# EAGLE schematic OOBD-Tiger (EAGLE 7.6.0)

## Sheet 1 of 5
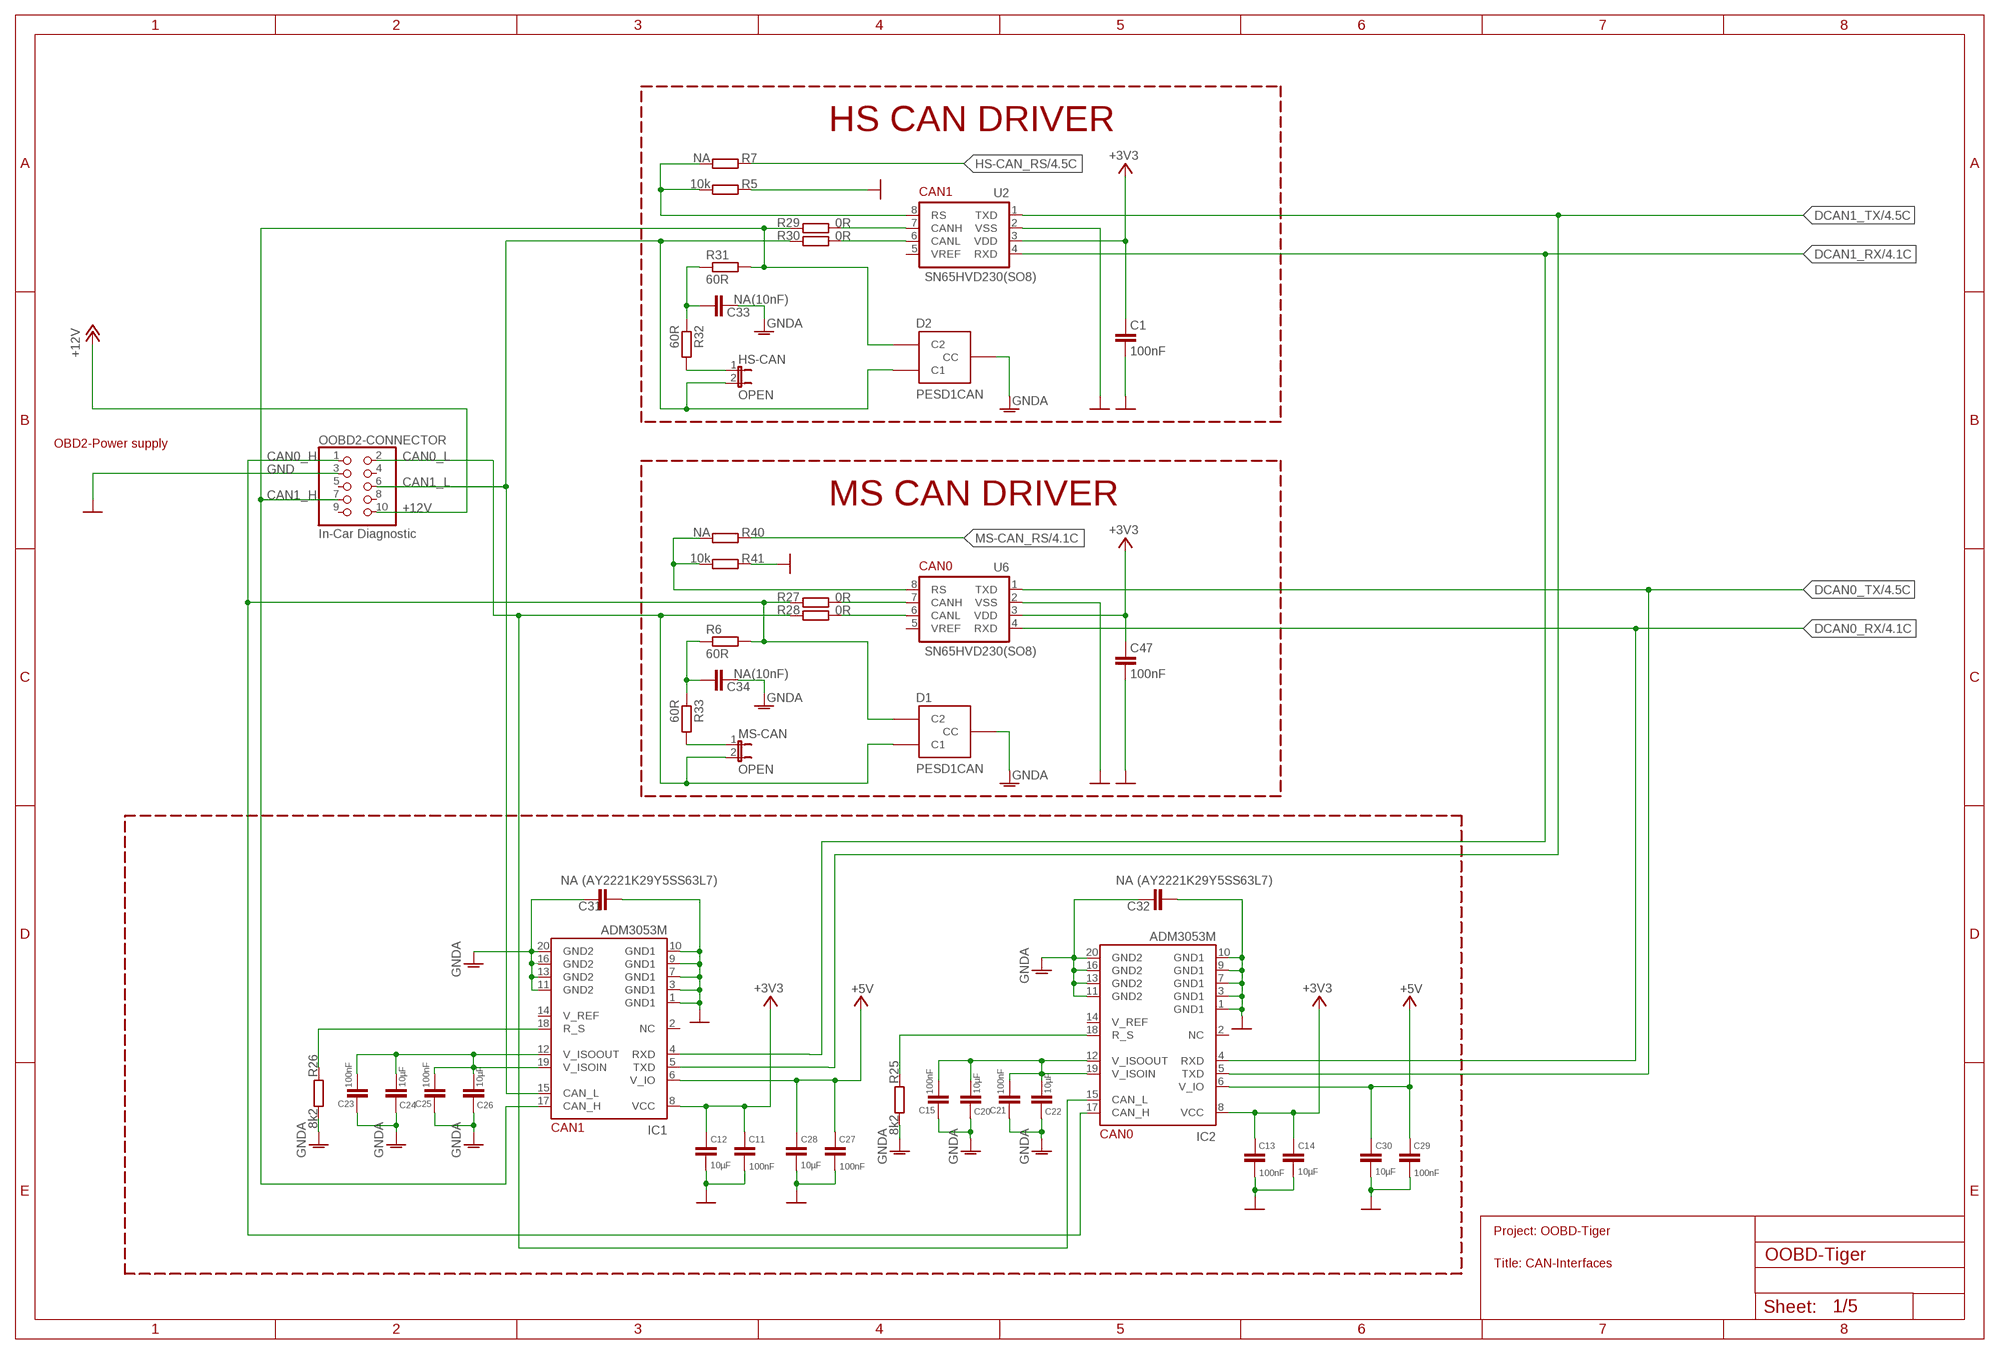
[diagram p0: schematic, sheet 1]

### Parts
C1  100nF  C-EUC0603K  [C0603K]
C11  100nF  C-EUC0603K  [C0603K]
C12  10µF  C-EUC0805K  [C0805K]
C13  100nF  C-EUC0603K  [C0603K]
C14  10µF  C-EUC0805K  [C0805K]
C15  100nF  C-EUC0603K  [C0603K]
C20  10µF  C-EUC0805K  [C0805K]
C21  100nF  C-EUC0603K  [C0603K]
C22  10µF  C-EUC0805K  [C0805K]
C23  100nF  C-EUC0603K  [C0603K]
C24  10µF  C-EUC0805K  [C0805K]
C25  100nF  C-EUC0603K  [C0603K]
C26  10µF  C-EUC0805K  [C0805K]
C27  100nF  C-EUC0603K  [C0603K]
C28  10µF  C-EUC0805K  [C0805K]
C29  100nF  C-EUC0603K  [C0603K]
C30  10µF  C-EUC0805K  [C0805K]
C31  NA (AY2221K29Y5SS63L7)  C-EU075-032X103  [C075-032X103]
C32  NA (AY2221K29Y5SS63L7)  C-EU075-032X103  [C075-032X103]
C33  NA(10nF)  C-EUC0603  [C0603]
C34  NA(10nF)  C-EUC0603  [C0603]
C47  100nF  C-EUC0603K  [C0603K]
D1  PESD1CAN  [SOT23]
D2  PESD1CAN  [SOT23]
HS-CAN  OPEN  JUMPER-2PTH  [1X02]
IC1  ADM3053M  [SO20W]
IC2  ADM3053M  [SO20W]
MS-CAN  OPEN  JUMPER-2PTH  [1X02]
OOBD2-CONNECTOR  In-Car Diagnostic  PINHD-2X5/90  [2X05/90]
R5  10k  R-EU_R0603  [R0603]
R6  60R  R-EU_R0603  [R0603]
R7  NA  R-EU_R0603  [R0603]
R25  8k2  R-EU_R0603  [R0603]
R26  8k2  R-EU_R0603  [R0603]
R27  0R  R-EU_0207/10  [0207/10]
R28  0R  R-EU_0207/10  [0207/10]
R29  0R  R-EU_0207/10  [0207/10]
R30  0R  R-EU_0207/10  [0207/10]
R31  60R  R-EU_R0603  [R0603]
R32  60R  R-EU_R0603  [R0603]
R33  60R  R-EU_R0603  [R0603]
R40  NA  R-EU_R0603  [R0603]
R41  10k  R-EU_R0603  [R0603]
U2  SN65HVD230(SO8)  MCP2551  [SO-08]
U6  SN65HVD230(SO8)  MCP2551  [SO-08]

### Nets
+3V3: C1.1 C11.1 C12.1 C13.1 C14.1 C47.1 IC1.8(VCC) IC2.8(VCC) U2.3(VDD) U6.3(VDD) ; also sheet 3,5
+5V: C27.1 C28.1 C29.1 C30.1 IC1.6(V_IO) IC2.6(V_IO) ; also sheet 2,3,4,5
+12V: OOBD2-CONNECTOR.10 ; also sheet 5
CAN0_H: D1.2(C2) IC2.17(CAN_H) OOBD2-CONNECTOR.1 R6.2 R27.1
CAN0_L: D1.1(C1) IC2.15(CAN_L) MS-CAN.2 OOBD2-CONNECTOR.2 R28.1
CAN1_H: D2.2(C2) IC1.17(CAN_H) OOBD2-CONNECTOR.7 R29.2 R31.2
CAN1_L: D2.1(C1) HS-CAN.2 IC1.15(CAN_L) OOBD2-CONNECTOR.6 R30.1
DCAN0_RX: IC2.4(RXD) U6.4(RXD) ; also sheet 4
DCAN0_TX: IC2.5(TXD) U6.1(TXD) ; also sheet 4
DCAN1_RX: IC1.4(RXD) U2.4(RXD) ; also sheet 4
DCAN1_TX: IC1.5(TXD) U2.1(TXD) ; also sheet 4
GND [PWR]: C1.2 C11.2 C12.2 C13.2 C14.2 C27.2 C28.2 C29.2 C30.2 C31.2 C32.2 C47.2 IC1.1(GND1) IC1.3(GND1) IC1.7(GND1) IC1.9(GND1) IC1.10(GND1) IC2.1(GND1) IC2.3(GND1) IC2.7(GND1) IC2.9(GND1) IC2.10(GND1) OOBD2-CONNECTOR.3 R5.2 R41.2 U2.2(VSS) U6.2(VSS) ; also sheet 2,3,4,5
GNDA [PWR]: C15.2 C20.2 C21.2 C22.2 C23.2 C24.2 C25.2 C26.2 C31.1 C32.1 C33.2 C34.2 D1.3(CC) D2.3(CC) IC1.11(GND2) IC1.13(GND2) IC1.16(GND2) IC1.20(GND2) IC2.11(GND2) IC2.13(GND2) IC2.16(GND2) IC2.20(GND2) R25.1 R26.1
HS-CAN_RS: R7.2 ; also sheet 4
MS-CAN_RS: R40.2 ; also sheet 4
N$2: C33.1 R31.1 R32.1
N$5: R5.1 R7.1 U2.8(RS)
N$10: C34.1 R6.1 R33.1
N$30: HS-CAN.1 R32.2
N$31: C23.1 C24.1 C25.1 C26.1 IC1.12(V_ISOOUT) IC1.19(V_ISOIN)
N$32: MS-CAN.1 R33.2
N$33: IC2.18(R_S) R25.2
N$40: R27.2 U6.7(CANH)
N$41: R30.2 U2.6(CANL)
N$42: R28.2 U6.6(CANL)
N$45: R29.1 U2.7(CANH)
N$50: C15.1 C20.1 C21.1 C22.1 IC2.12(V_ISOOUT) IC2.19(V_ISOIN)
N$52: IC1.18(R_S) R26.2
N$80: R40.1 R41.1 U6.8(RS)
Unconnected: IC1.2(NC) IC1.14(V_REF) IC2.2(NC) IC2.14(V_REF) OOBD2-CONNECTOR.4 OOBD2-CONNECTOR.5 OOBD2-CONNECTOR.8 OOBD2-CONNECTOR.9 U2.5(VREF) U6.5(VREF)

### Notes on the sheet
- HS CAN DRIVER
- CAN1
- OBD2-Power supply
- MS CAN DRIVER
- CAN0
- DCAN0_TX
- DCAN0_RX
- CAN1
- CAN0
- Project: OOBD-Tiger
- Title: CAN-Interfaces

## Sheet 2 of 5
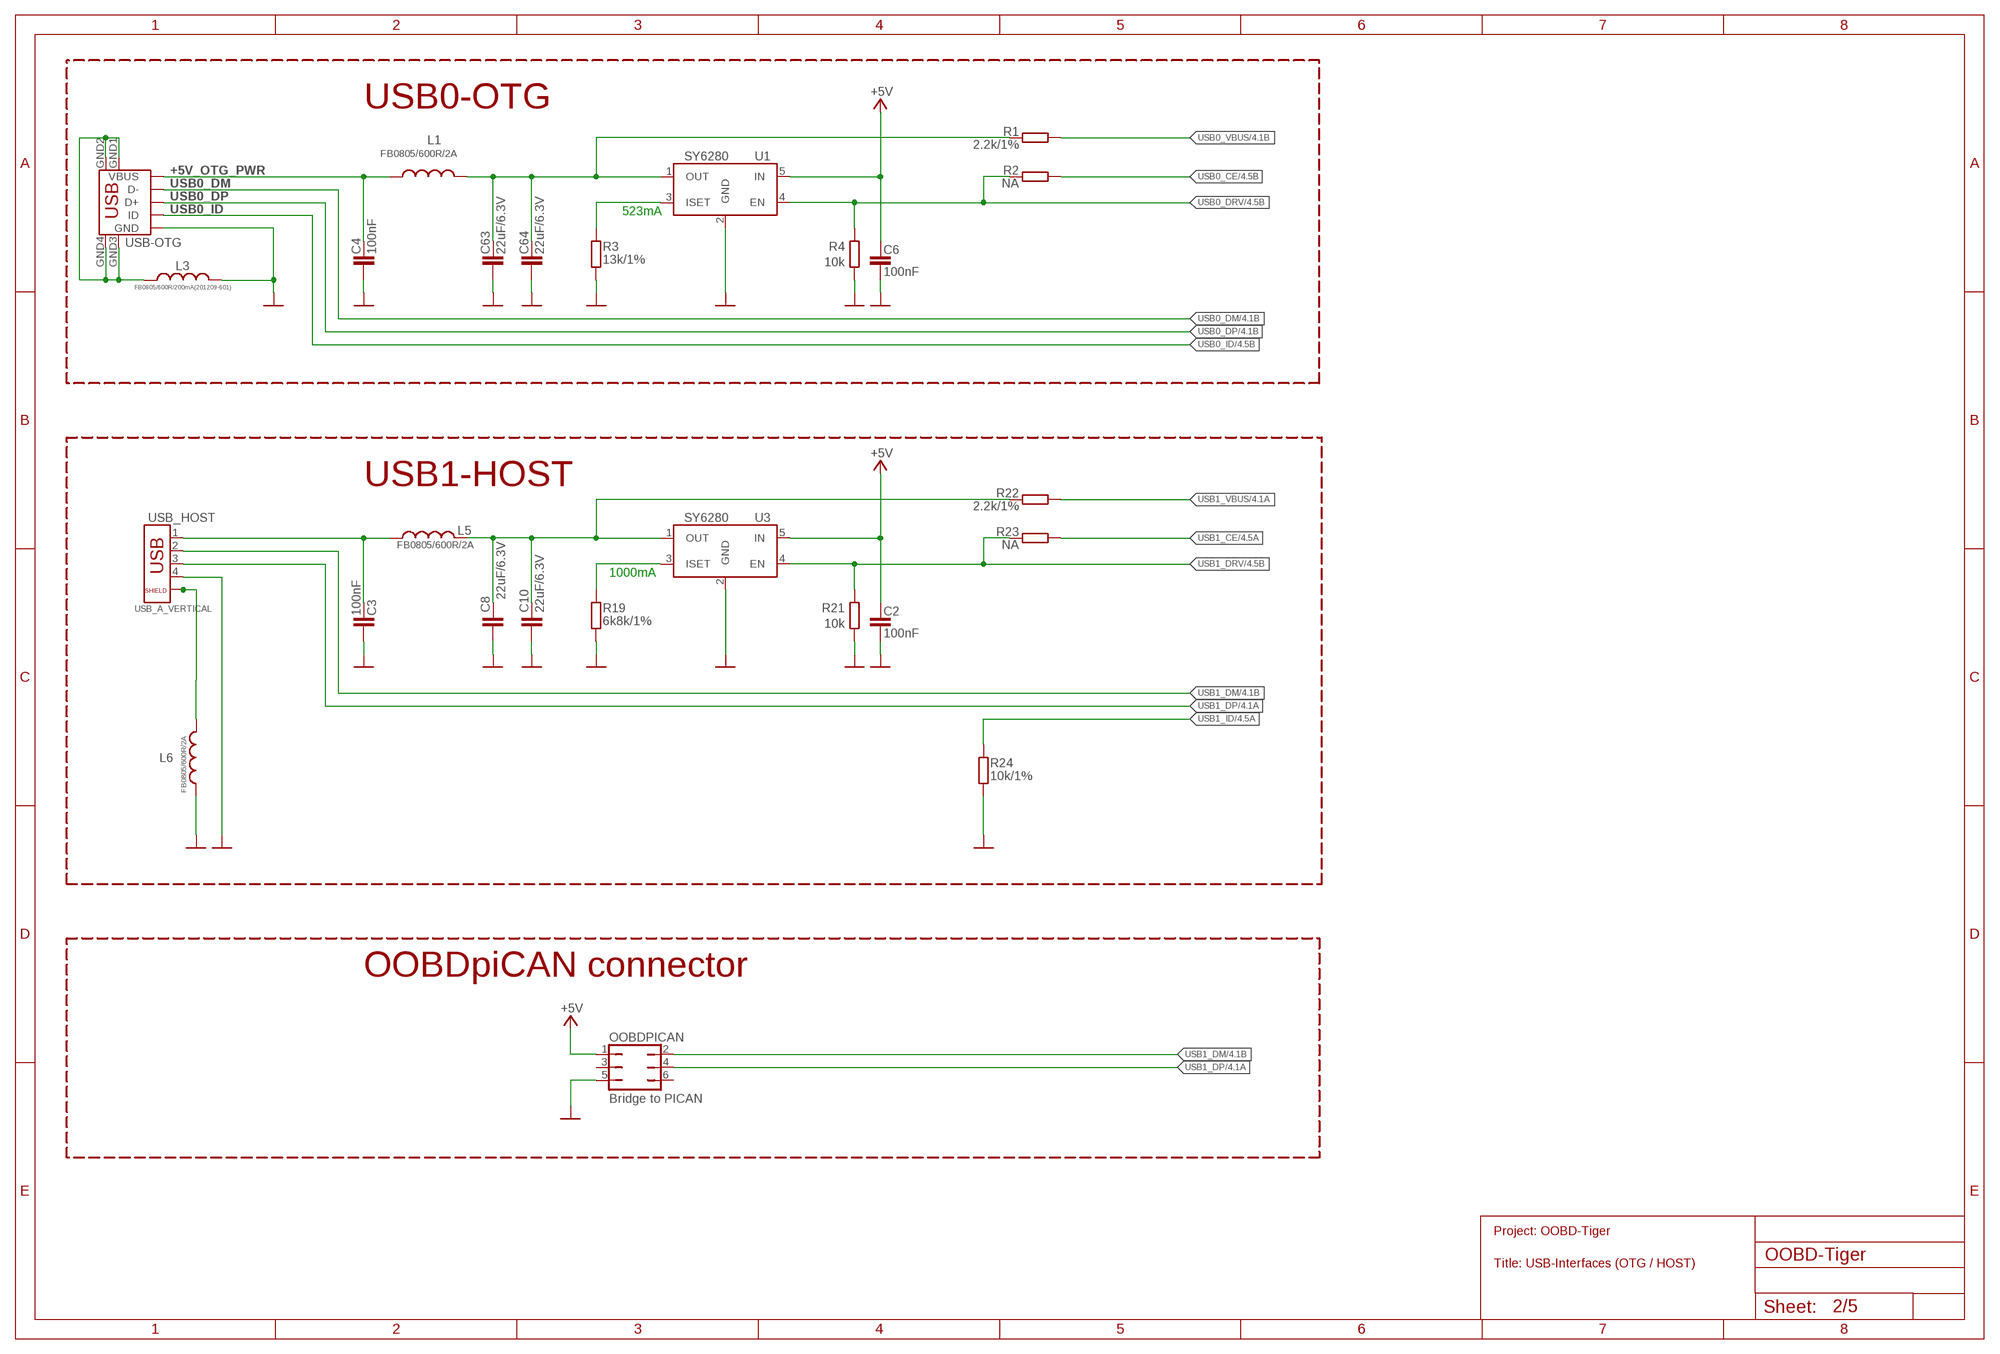
[diagram p1: schematic, sheet 2]

### Parts
C2  100nF  C-EUC0603K  [C0603K]
C3  100nF  C-EUC0603K  [C0603K]
C4  100nF  C-EUC0603K  [C0603K]
C6  100nF  C-EUC0603K  [C0603K]
C8  22uF/6.3V  C-EUC0603  [C0603]
C10  22uF/6.3V  C-EUC0603  [C0603]
C63  22uF/6.3V  C-EUC0603  [C0603]
C64  22uF/6.3V  C-EUC0603  [C0603]
L1  FB0805/600R/2A  L-USL0603  [L0603]
L3  FB0805/600R/200mA(201209-601)  L-USL0603  [L0603]
L5  FB0805/600R/2A  L-USL0603  [L0603]
L6  FB0805/600R/2A  L-USL0603  [L0603]
OOBDPICAN  Bridge to PICAN  JP3Q  [JP3Q]
R1  2.2k/1%  R-EU_R0603  [R0603]
R2  NA  R-EU_R0603  [R0603]
R3  13k/1%  R-EU_R0603  [R0603]
R4  10k  R-EU_R0603  [R0603]
R19  6k8k/1%  R-EU_R0603  [R0603]
R21  10k  R-EU_R0603  [R0603]
R22  2.2k/1%  R-EU_R0603  [R0603]
R23  NA  R-EU_R0603  [R0603]
R24  10k/1%  R-EU_R0603  [R0603]
U1  SY6280  [SOT23-5]
U3  SY6280  [SOT23-5]
USB_HOST  USB_A_VERTICAL  USB_SHIELD1  [USB_PN87520_DEV_PTH]
USB_OTG  USB-OTG  MINI_USB9  [USB_MINI_9PIN]

### Nets
+5V: C2.1 C6.1 OOBDPICAN.1 U1.5(IN) U3.5(IN) ; also sheet 1,3,4,5
+5V_OTG_PWR: C4.1 L1.1 USB_OTG.VBUS
GND [PWR]: C2.2 C3.2 C4.2 C6.2 C8.2 C10.2 C63.2 C64.2 L3.1 L6.1 OOBDPICAN.5 R3.1 R4.1 R19.1 R21.1 R24.1 U1.2(GND) U3.2(GND) USB_HOST.4 USB_OTG.GND ; also sheet 1,3,4,5
N$3: R19.2 U3.3(ISET)
N$13: C8.1 C10.1 L5.1 R22.2 U3.1(OUT)
N$28: C3.1 L5.2 USB_HOST.1
N$29: L6.2 USB_HOST.P$1 USB_HOST.P$2
N$99: R3.2 U1.3(ISET)
N$100: C63.1 C64.1 L1.2 R1.2 U1.1(OUT)
N$266: L3.2 USB_OTG.GND1 USB_OTG.GND2 USB_OTG.GND3 USB_OTG.GND4
USB0_CE: R2.2 ; also sheet 4
USB0_DM: USB_OTG.D- ; also sheet 4
USB0_DP: USB_OTG.D+ ; also sheet 4
USB0_DRV: R2.1 R4.2 U1.4(EN) ; also sheet 4
USB0_ID: USB_OTG.ID ; also sheet 4
USB0_VBUS: R1.1 ; also sheet 4
USB1_CE: R23.2 ; also sheet 4
USB1_DM: OOBDPICAN.2 USB_HOST.2 ; also sheet 4
USB1_DP: OOBDPICAN.4 USB_HOST.3 ; also sheet 4
USB1_DRV: R21.2 R23.1 U3.4(EN) ; also sheet 4
USB1_ID: R24.2 ; also sheet 4
USB1_VBUS: R22.1 ; also sheet 4
Unconnected: OOBDPICAN.3 OOBDPICAN.6

### Notes on the sheet
- USB0-OTG
- 523mA
- Iset = 6800/Rs
- Rs
- Iset = 523mA
- USB1-HOST
- 1000mA
- OOBDpiCAN connector
- Project: OOBD-Tiger
- Title: USB-Interfaces (OTG / HOST)

## Sheet 3 of 5
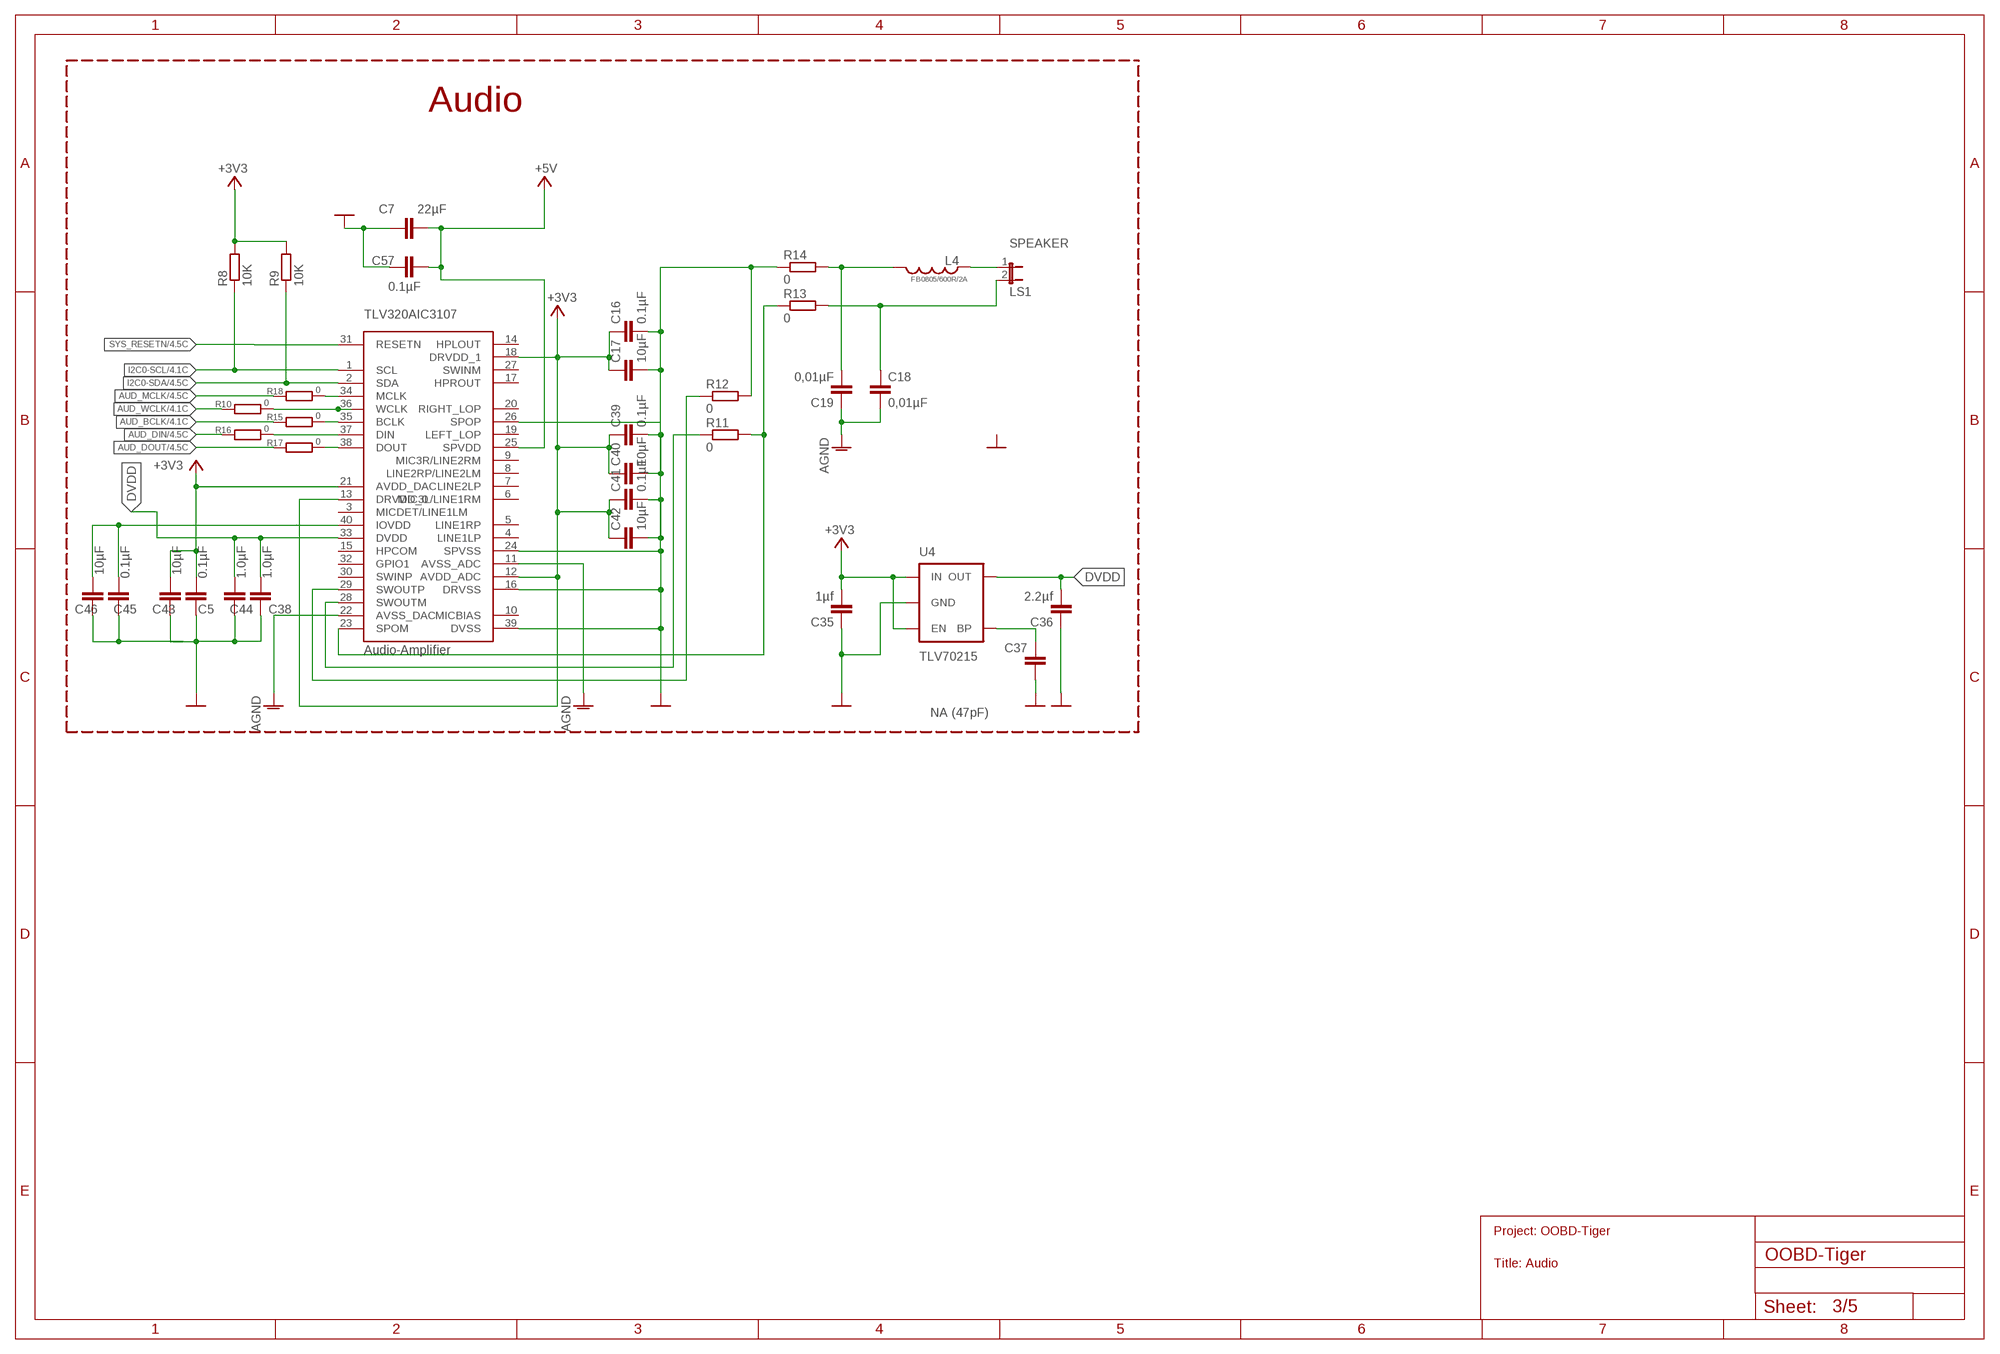
[diagram p2: schematic, sheet 3]

### Parts
C5  0.1µF  CAP0603-CAP  [0603-CAP]
C7  22µF  CAP0603-CAP  [0603-CAP]
C16  0.1µF  CAP0603-CAP  [0603-CAP]
C17  10µF  CAP0603-CAP  [0603-CAP]
C18  0,01µF  CAP0603-CAP  [0603-CAP]
C19  0,01µF  CAP0603-CAP  [0603-CAP]
C35  1µf  CAP0603-CAP  [0603-CAP]
C36  2.2µf  CAP0603-CAP  [0603-CAP]
C37  NA (47pF)  CAP0603-CAP  [0603-CAP]
C38  1.0µF  CAP0603-CAP  [0603-CAP]
C39  0.1µF  CAP0603-CAP  [0603-CAP]
C40  10µF  CAP0603-CAP  [0603-CAP]
C41  0.1µF  CAP0603-CAP  [0603-CAP]
C42  10µF  CAP0603-CAP  [0603-CAP]
C43  10µF  CAP0603-CAP  [0603-CAP]
C44  1.0µF  CAP0603-CAP  [0603-CAP]
C45  0.1µF  CAP0603-CAP  [0603-CAP]
C46  10µF  CAP0603-CAP  [0603-CAP]
C57  0.1µF  CAP0603-CAP  [0603-CAP]
L4  FB0805/600R/2A  L-USL0603  [L0603]
R8  10K  R-EU_R0603  [R0603]
R9  10K  R-EU_R0603  [R0603]
R10  0  R-EU_R0603  [R0603]
R11  0  R-EU_R0603  [R0603]
R12  0  R-EU_R0603  [R0603]
R13  0  R-EU_R0603  [R0603]
R14  0  R-EU_R0603  [R0603]
R15  0  R-EU_R0603  [R0603]
R16  0  R-EU_R0603  [R0603]
R17  0  R-EU_R0603  [R0603]
R18  0  R-EU_R0603  [R0603]
SPEAKER  LS1  JUMPER-2PTH  [1X02]
TLV320AIC3107  Audio-Amplifier  TLV320AIC3107  [QFN40-6X6]
U4  TLV70215  V_REG_LDOSMD  [SOT23-5]

### Nets
+3V3: C5.2 C16.1 C17.1 C35.2 C39.1 C40.1 C41.1 C42.1 C43.2 R8.2 R9.2 TLV320AIC3107.12(AVDD_ADC) TLV320AIC3107.13(DRVDD_0) TLV320AIC3107.18(DRVDD_1) TLV320AIC3107.21(AVDD_DAC) U4.1(IN) U4.3(EN) ; also sheet 1,5
+5V: C7.2 C57.2 TLV320AIC3107.25(SPVDD) ; also sheet 1,2,4,5
AGND: C18.2 C19.1 TLV320AIC3107.11(AVSS_ADC) TLV320AIC3107.22(AVSS_DAC)
AUD_BCLK: R15.1 ; also sheet 4
AUD_DIN: R16.1 ; also sheet 4
AUD_DOUT: R17.1 ; also sheet 4
AUD_MCLK: R18.1 ; also sheet 4
AUD_WCLK: R10.1 ; also sheet 4
DVDD: C36.2 C38.2 C44.2 TLV320AIC3107.33(DVDD) U4.5(OUT)
GND [PWR]: C5.1 C7.1 C16.2 C17.2 C35.1 C36.1 C37.1 C38.1 C39.2 C40.2 C41.2 C42.2 C43.1 C44.1 C57.1 R12.2 R14.1 TLV320AIC3107.16(DRVSS) TLV320AIC3107.24(SPVSS) TLV320AIC3107.26(SPOP) TLV320AIC3107.39(DVSS) U4.2(GND) ; also sheet 1,2,4,5
GND1 [PWR]: C45.1 C46.1
I2C0-SCL: R8.1 TLV320AIC3107.1(SCL) ; also sheet 4,5
I2C0-SDA: R9.1 TLV320AIC3107.2(SDA) ; also sheet 4,5
N$12: C37.2 U4.4(BP)
N$14: C19.2 L4.2 R14.2
N$15: C18.1 R13.2 SPEAKER.2
N$16: L4.1 SPEAKER.1
N$18: R11.2 R13.1 TLV320AIC3107.23(SPOM)
N$19: R11.1 TLV320AIC3107.28(SWOUTM)
N$20: R12.1 TLV320AIC3107.29(SWOUTP)
N$21: C45.2 C46.2 TLV320AIC3107.40(IOVDD)
N$22: R17.2 TLV320AIC3107.38(DOUT)
N$23: R16.2 TLV320AIC3107.37(DIN)
N$24: R15.2 TLV320AIC3107.35(BCLK)
N$25: R10.2 TLV320AIC3107.36(WCLK)
N$26: R18.2 TLV320AIC3107.34(MCLK)
SYS_RESETN: TLV320AIC3107.31(RESETN) ; also sheet 4,5
Unconnected: TLV320AIC3107.3(MICDET/LINE1LM) TLV320AIC3107.4(LINE1LP) TLV320AIC3107.5(LINE1RP) TLV320AIC3107.6(MIC3L/LINE1RM) TLV320AIC3107.7(LINE2LP) TLV320AIC3107.8(LINE2RP/LINE2LM) TLV320AIC3107.9(MIC3R/LINE2RM) TLV320AIC3107.10(MICBIAS) TLV320AIC3107.14(HPLOUT) TLV320AIC3107.15(HPCOM) TLV320AIC3107.17(HPROUT) TLV320AIC3107.19(LEFT_LOP) TLV320AIC3107.20(RIGHT_LOP) TLV320AIC3107.27(SWINM) TLV320AIC3107.30(SWINP) TLV320AIC3107.32(GPIO1)

### Notes on the sheet
- Audio
- Project: OOBD-Tiger
- Title: Audio

## Sheet 4 of 5
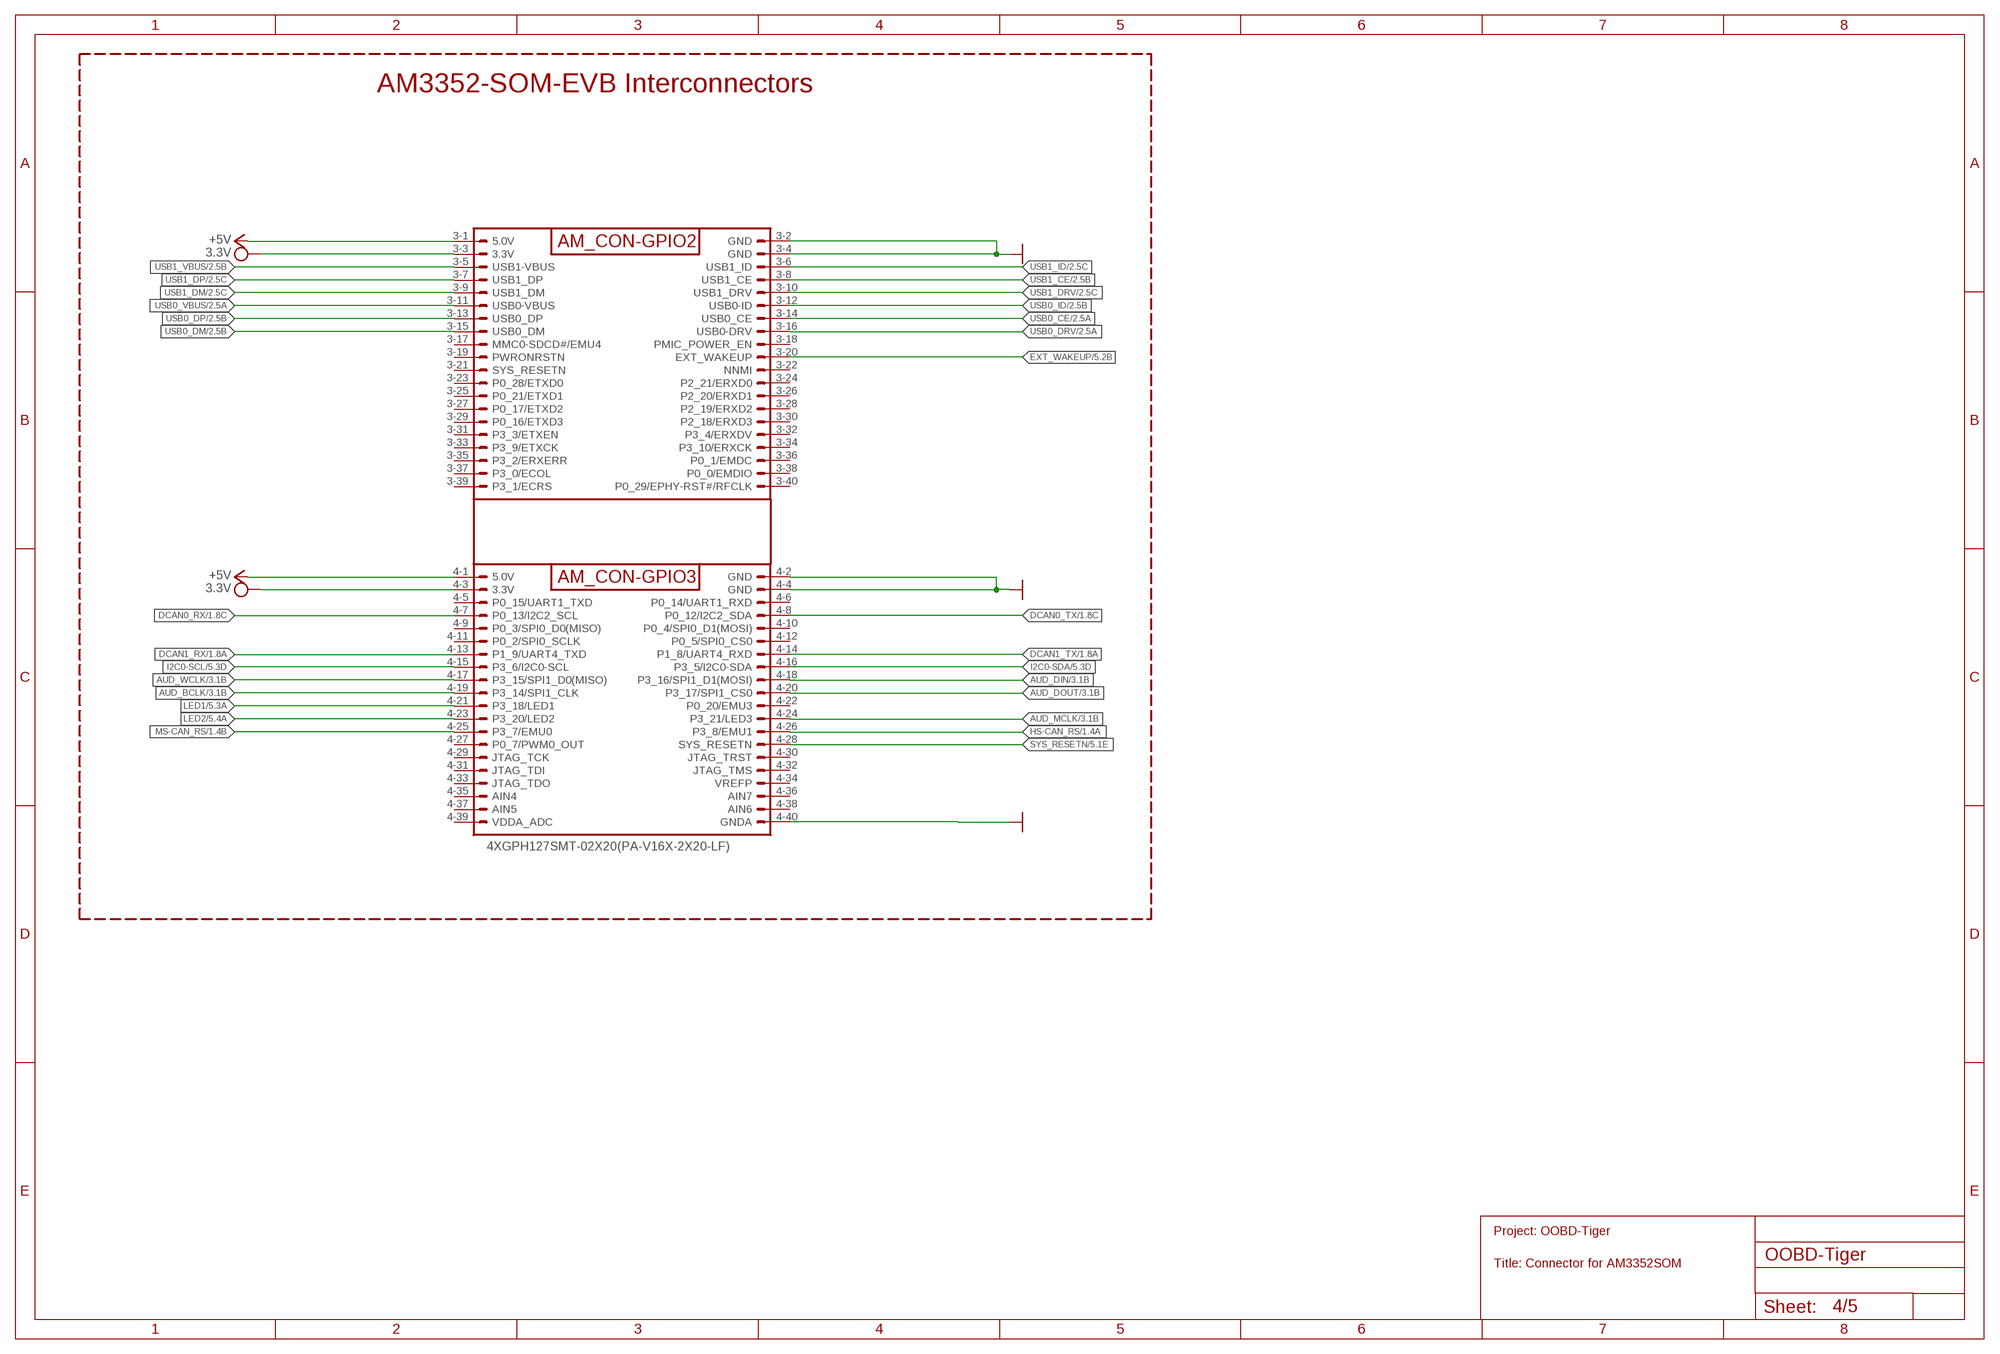
[diagram p3: schematic, sheet 4]

### Parts
AM3352-SOM-EVB-PLATFORM  4XGPH127SMT-02X20(PA-V16X-2X20-LF)  OOBD-TIGER-AM3352-SOM---4XGPH127SMT-02X20(PA-V16X-2X20-LF)  [OOBD-TIGER-AM3352-SOM]

### Nets
3V3 [PWR]: AM3352-SOM-EVB-PLATFORM.3-3(3.3V) AM3352-SOM-EVB-PLATFORM.4-3(3.3V) ; supply symbol labelled 3.3V
+5V: AM3352-SOM-EVB-PLATFORM.3-1(5.0V) AM3352-SOM-EVB-PLATFORM.4-1(5.0V) ; also sheet 1,2,3,5
AUD_BCLK: AM3352-SOM-EVB-PLATFORM.4-19(P3_14/SPI1_CLK) ; also sheet 3
AUD_DIN: AM3352-SOM-EVB-PLATFORM.4-18(P3_16/SPI1_D1(MOSI)) ; also sheet 3
AUD_DOUT: AM3352-SOM-EVB-PLATFORM.4-20(P3_17/SPI1_CS0) ; also sheet 3
AUD_MCLK: AM3352-SOM-EVB-PLATFORM.4-24(P3_21/LED3) ; also sheet 3
AUD_WCLK: AM3352-SOM-EVB-PLATFORM.4-17(P3_15/SPI1_D0(MISO)) ; also sheet 3
DCAN0_RX: AM3352-SOM-EVB-PLATFORM.4-7(P0_13/I2C2_SCL) ; also sheet 1
DCAN0_TX: AM3352-SOM-EVB-PLATFORM.4-8(P0_12/I2C2_SDA) ; also sheet 1
DCAN1_RX: AM3352-SOM-EVB-PLATFORM.4-13(P1_9/UART4_TXD) ; also sheet 1
DCAN1_TX: AM3352-SOM-EVB-PLATFORM.4-14(P1_8/UART4_RXD) ; also sheet 1
EXT_WAKEUP: AM3352-SOM-EVB-PLATFORM.3-20(EXT_WAKEUP) ; also sheet 5
GND [PWR]: AM3352-SOM-EVB-PLATFORM.3-2(GND) AM3352-SOM-EVB-PLATFORM.3-4(GND) AM3352-SOM-EVB-PLATFORM.4-2(GND) AM3352-SOM-EVB-PLATFORM.4-4(GND) AM3352-SOM-EVB-PLATFORM.4-40(GNDA) ; also sheet 1,2,3,5
HS-CAN_RS: AM3352-SOM-EVB-PLATFORM.4-26(P3_8/EMU1) ; also sheet 1
I2C0-SCL: AM3352-SOM-EVB-PLATFORM.4-15(P3_6/I2C0-SCL) ; also sheet 3,5
I2C0-SDA: AM3352-SOM-EVB-PLATFORM.4-16(P3_5/I2C0-SDA) ; also sheet 3,5
LED1: AM3352-SOM-EVB-PLATFORM.4-21(P3_18/LED1) ; also sheet 5
LED2: AM3352-SOM-EVB-PLATFORM.4-23(P3_20/LED2) ; also sheet 5
MS-CAN_RS: AM3352-SOM-EVB-PLATFORM.4-25(P3_7/EMU0) ; also sheet 1
SYS_RESETN: AM3352-SOM-EVB-PLATFORM.4-28(SYS_RESETN) ; also sheet 3,5
USB0_CE: AM3352-SOM-EVB-PLATFORM.3-14(USB0_CE) ; also sheet 2
USB0_DM: AM3352-SOM-EVB-PLATFORM.3-15(USB0_DM) ; also sheet 2
USB0_DP: AM3352-SOM-EVB-PLATFORM.3-13(USB0_DP) ; also sheet 2
USB0_DRV: AM3352-SOM-EVB-PLATFORM.3-16(USB0-DRV) ; also sheet 2
USB0_ID: AM3352-SOM-EVB-PLATFORM.3-12(USB0-ID) ; also sheet 2
USB0_VBUS: AM3352-SOM-EVB-PLATFORM.3-11(USB0-VBUS) ; also sheet 2
USB1_CE: AM3352-SOM-EVB-PLATFORM.3-8(USB1_CE) ; also sheet 2
USB1_DM: AM3352-SOM-EVB-PLATFORM.3-9(USB1_DM) ; also sheet 2
USB1_DP: AM3352-SOM-EVB-PLATFORM.3-7(USB1_DP) ; also sheet 2
USB1_DRV: AM3352-SOM-EVB-PLATFORM.3-10(USB1_DRV) ; also sheet 2
USB1_ID: AM3352-SOM-EVB-PLATFORM.3-6(USB1_ID) ; also sheet 2
USB1_VBUS: AM3352-SOM-EVB-PLATFORM.3-5(USB1-VBUS) ; also sheet 2
Unconnected: AM3352-SOM-EVB-PLATFORM.3-17(MMC0-SDCD#/EMU4) AM3352-SOM-EVB-PLATFORM.3-18(PMIC_POWER_EN) AM3352-SOM-EVB-PLATFORM.3-19(PWRONRSTN) AM3352-SOM-EVB-PLATFORM.3-21(SYS_RESETN) AM3352-SOM-EVB-PLATFORM.3-22(NNMI) AM3352-SOM-EVB-PLATFORM.3-23(P0_28/ETXD0) AM3352-SOM-EVB-PLATFORM.3-24(P2_21/ERXD0) AM3352-SOM-EVB-PLATFORM.3-25(P0_21/ETXD1) AM3352-SOM-EVB-PLATFORM.3-26(P2_20/ERXD1) AM3352-SOM-EVB-PLATFORM.3-27(P0_17/ETXD2) AM3352-SOM-EVB-PLATFORM.3-28(P2_19/ERXD2) AM3352-SOM-EVB-PLATFORM.3-29(P0_16/ETXD3) AM3352-SOM-EVB-PLATFORM.3-30(P2_18/ERXD3) AM3352-SOM-EVB-PLATFORM.3-31(P3_3/ETXEN) AM3352-SOM-EVB-PLATFORM.3-32(P3_4/ERXDV) AM3352-SOM-EVB-PLATFORM.3-33(P3_9/ETXCK) AM3352-SOM-EVB-PLATFORM.3-34(P3_10/ERXCK) AM3352-SOM-EVB-PLATFORM.3-35(P3_2/ERXERR) AM3352-SOM-EVB-PLATFORM.3-36(P0_1/EMDC) AM3352-SOM-EVB-PLATFORM.3-37(P3_0/ECOL) AM3352-SOM-EVB-PLATFORM.3-38(P0_0/EMDIO) AM3352-SOM-EVB-PLATFORM.3-39(P3_1/ECRS) AM3352-SOM-EVB-PLATFORM.3-40(P0_29/EPHY-RST#/RFCLK) AM3352-SOM-EVB-PLATFORM.4-5(P0_15/UART1_TXD) AM3352-SOM-EVB-PLATFORM.4-6(P0_14/UART1_RXD) AM3352-SOM-EVB-PLATFORM.4-9(P0_3/SPI0_D0(MISO)) AM3352-SOM-EVB-PLATFORM.4-10(P0_4/SPI0_D1(MOSI)) AM3352-SOM-EVB-PLATFORM.4-11(P0_2/SPI0_SCLK) AM3352-SOM-EVB-PLATFORM.4-12(P0_5/SPI0_CS0) AM3352-SOM-EVB-PLATFORM.4-22(P0_20/EMU3) AM3352-SOM-EVB-PLATFORM.4-27(P0_7/PWM0_OUT) AM3352-SOM-EVB-PLATFORM.4-29(JTAG_TCK) AM3352-SOM-EVB-PLATFORM.4-30(JTAG_TRST) AM3352-SOM-EVB-PLATFORM.4-31(JTAG_TDI) AM3352-SOM-EVB-PLATFORM.4-32(JTAG_TMS) AM3352-SOM-EVB-PLATFORM.4-33(JTAG_TDO) AM3352-SOM-EVB-PLATFORM.4-34(VREFP) AM3352-SOM-EVB-PLATFORM.4-35(AIN4) AM3352-SOM-EVB-PLATFORM.4-36(AIN7) AM3352-SOM-EVB-PLATFORM.4-37(AIN5) AM3352-SOM-EVB-PLATFORM.4-38(AIN6) AM3352-SOM-EVB-PLATFORM.4-39(VDDA_ADC)

### Notes on the sheet
- AM3352-SOM-EVB Interconnectors
- Project: OOBD-Tiger
- Title: Connector for AM3352SOM

## Sheet 5 of 5
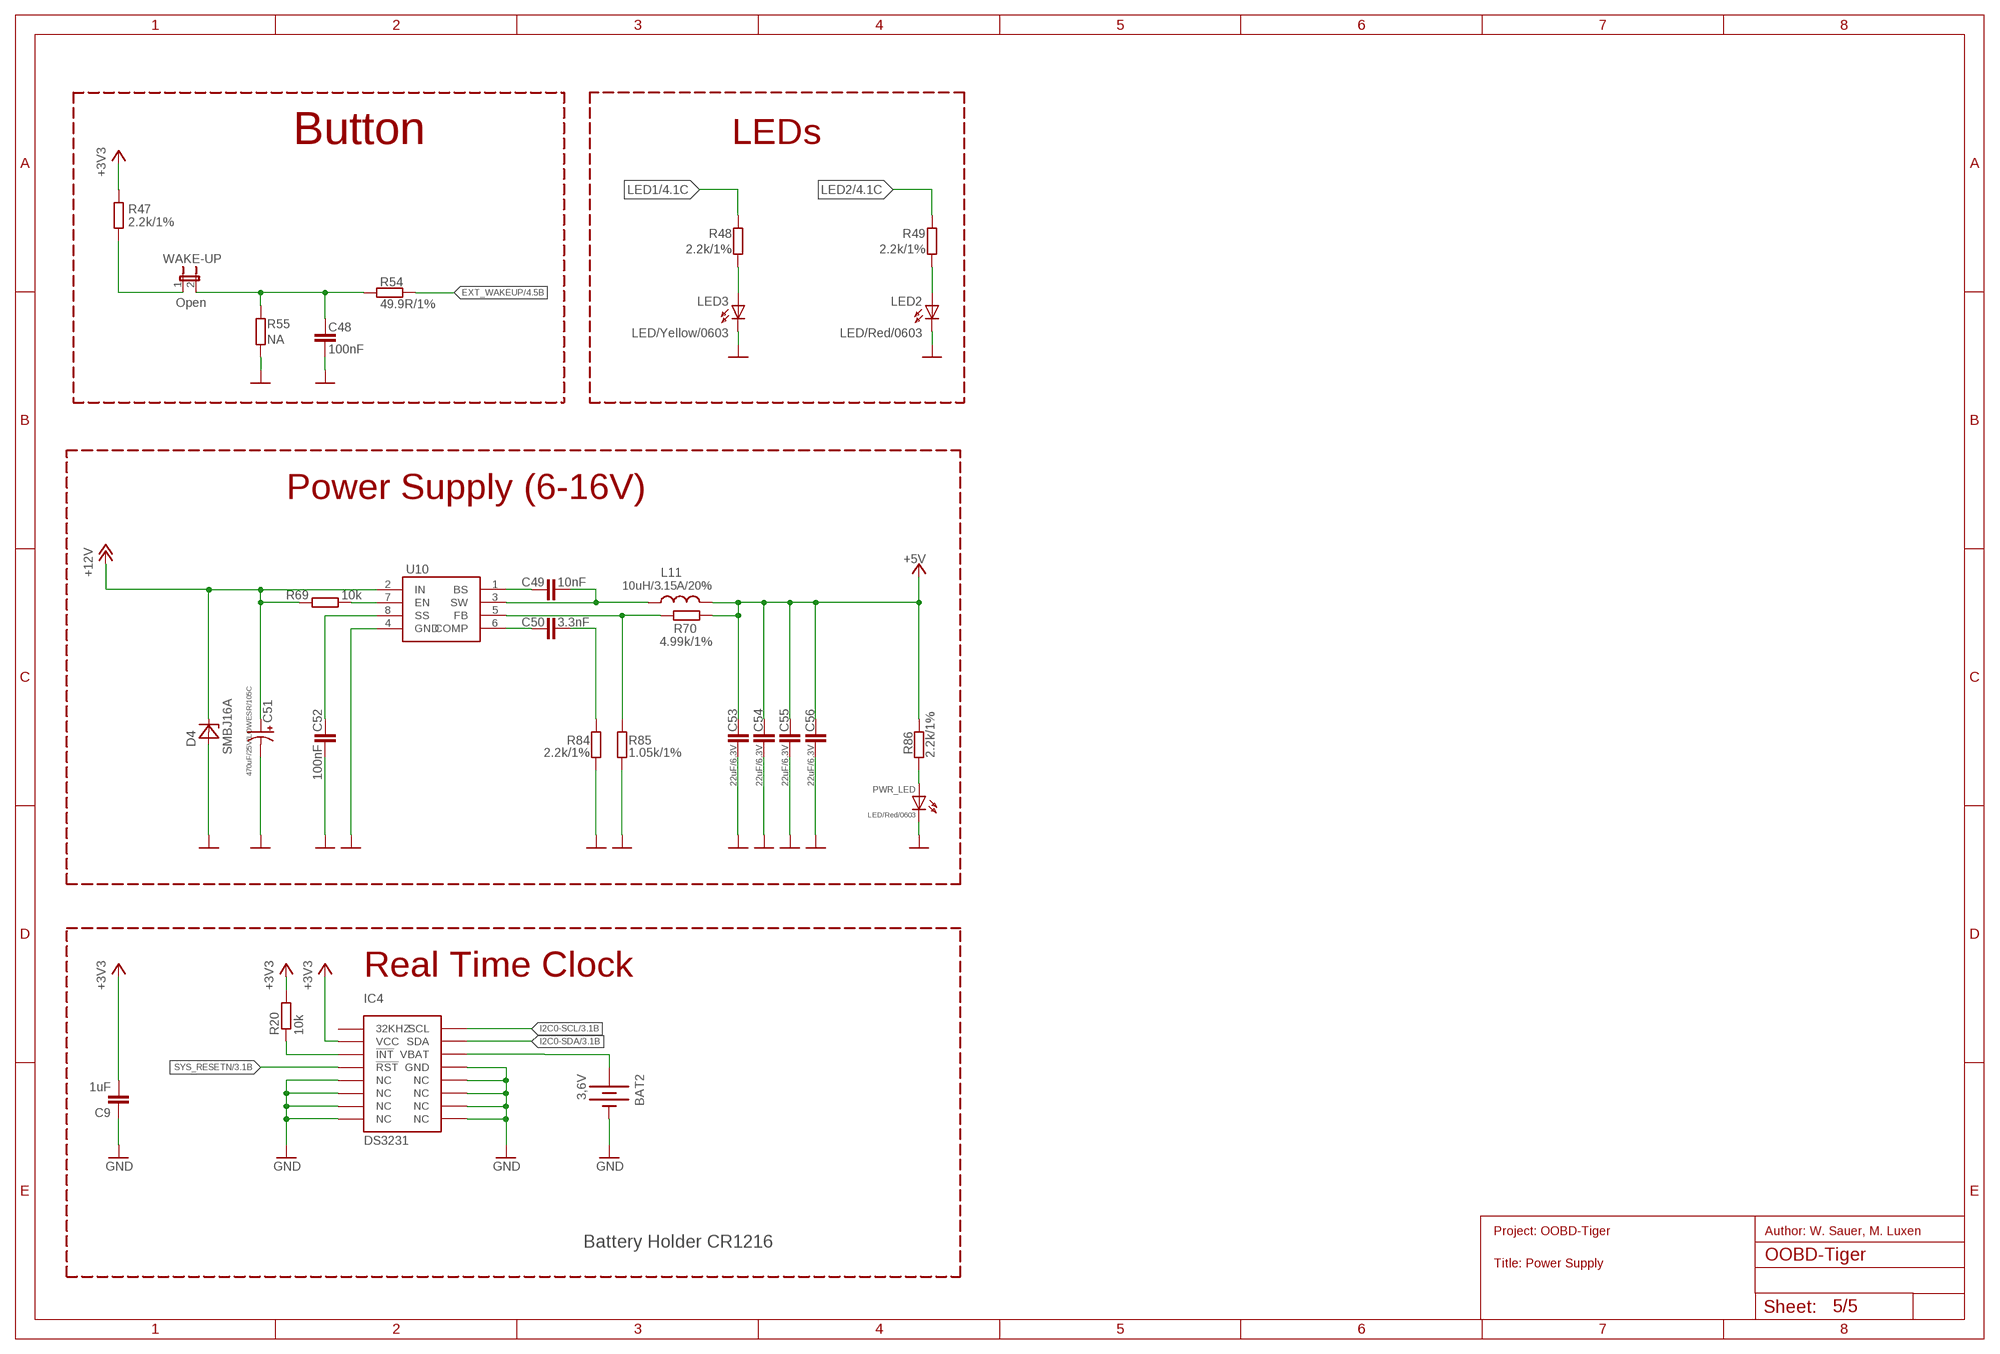
[diagram p4: schematic, sheet 5]

### Parts
BAT2  3,6V  BATTERY12PTH  [BATTCON_12MM_PTH]
C9  1uF  C-EUC0603  [C0603]
C48  100nF  C-EUC0603  [C0603]
C49  10nF  C-EUC0603  [C0603]
C50  3.3nF  C-EUC0603  [C0603]
C51  470uF/25V/LOWESR/105C  47UF-50V-20%(ELECT)  [PANASONIC_D]
C52  100nF  C-EUC0603  [C0603]
C53  22uF/6.3V  C-EUC0603  [C0603]
C54  22uF/6.3V  C-EUC0603  [C0603]
C55  22uF/6.3V  C-EUC0603  [C0603]
C56  22uF/6.3V  C-EUC0603  [C0603]
D4  SMBJ16A  [DO214AA]
IC4  DS3231  DS3231SOIC-16W  [SOIC-16W]
L11  10uH/3.15A/20%  LLQH88PN100M38  [8X8MM_3131]
LED2  LED/Red/0603  LEDLED_0603  [LED_0603]
LED3  LED/Yellow/0603  LEDLED_0603  [LED_0603]
PWR_LED  LED/Red/0603  LED0603DWS  [LED-0603]
R20  10k  R-EU_R0603  [R0603]
R47  2.2k/1%  R-EU_R0603  [R0603]
R48  2.2k/1%  R-EU_R0603  [R0603]
R49  2.2k/1%  R-EU_R0603  [R0603]
R54  49.9R/1%  R-EU_R0603  [R0603]
R55  NA  R-EU_R0603  [R0603]
R69  10k  R-EU_R0603  [R0603]
R70  4.99k/1%  R-EU_R0603  [R0603]
R84  2.2k/1%  R-EU_R0603  [R0603]
R85  1.05k/1%  R-EU_R0603  [R0603]
R86  2.2k/1%  R-EU_R0603  [R0603]
U10  MP1482DS  MP1482  [SOIC8]
WAKE-UP  Open  JUMPER-2PTH_LOCK  [1X02_LOCK]

### Nets
+3V3: C9.2 IC4.2(VCC) R20.2 R47.2 ; also sheet 1,3
+5V: C53.1 C54.1 C55.1 C56.1 L11.2 R70.2 R86.1 ; also sheet 1,2,3,4
+12V: C51.+ D4.C R69.1 U10.2(IN) ; also sheet 1
EXT_WAKEUP: R54.1 ; also sheet 4
GND [PWR]: BAT2.GND(-) C9.1 C48.2 C51.- C52.2 C53.2 C54.2 C55.2 C56.2 D4.A IC4.5(NC) IC4.6(NC) IC4.7(NC) IC4.8(NC) IC4.9(NC) IC4.10(NC) IC4.11(NC) IC4.12(NC) IC4.13(GND) LED2.C LED3.C PWR_LED.C R55.2 R84.2 R85.2 U10.4(GND) ; also sheet 1,2,3,4
I2C0-SCL: IC4.16(SCL) ; also sheet 3,4
I2C0-SDA: IC4.15(SDA) ; also sheet 3,4
LED1: R48.1 ; also sheet 4
LED2: R49.1 ; also sheet 4
N$1: LED2.A R49.2
N$4: C52.1 U10.8(SS)
N$6: R69.2 U10.7(EN)
N$7: C49.1 U10.1(BS)
N$8: C49.2 L11.1 U10.3(SW)
N$9: C50.1 U10.6(COMP)
N$11: C50.2 R84.1
N$27: IC4.3(!INT) R20.1
N$43: R47.1 WAKE-UP.1
N$44: C48.1 R54.2 R55.1 WAKE-UP.2
N$62: R70.1 R85.1 U10.5(FB)
N$129: PWR_LED.A R86.2
N$231: LED3.A R48.2
SYS_RESETN: IC4.4(!RST) ; also sheet 3,4
VBAT: BAT2.VCC@1(+) IC4.14(VBAT)
Unconnected: IC4.1(32KHZ)

### Notes on the sheet
- Button | LEDs
- Power Supply (6-16V)
- Ra
- Vout=0.923x(1+Ra/Rb)
- Rb
- Real Time Clock
- Project: OOBD-Tiger | Author: W. Sauer, M. Luxen
- Battery Holder CR1216
- Title: Power Supply

## Library data of the parts
AM3352-SOM-EVB-PLATFORM = OOBDtiger-Connector:OOBD-TIGER-AM3352-SOM: OOBD-Tiger AM3352-SOM Interface
BAT2 = SparkFun:BATTERY: Battery Holders Various common sizes : AA, AAA, 20mm coin cell and 12mm coin cell.
C1-C4 C6 C8-C15 C20-C32 C47-C50 C52-C56 C63 C64 = rcl:C-EU: CAPACITOR, European symbol
C5 C7 C18 C19 C37 C38 C43-C46 C57 = SparkFun-Passives:CAP: Capacitor Standard 0603 ceramic capacitor, and 0.1" leaded capacitor.; MANEX: 123-0001115
C16 C17 C35 C36 C39-C42 = SparkFun-Passives:CAP: Capacitor Standard 0603 ceramic capacitor, and 0.1" leaded capacitor.; MANEX: 123-0001032
C33 C34 = resistor:C-EU: CAPACITOR, European symbol
C51 = SparkFun-Capacitors:47UF-50V-20%(ELECT): CAP-10547; PROD_ID: CAP-10547
D1 D2 = Industrialberry:PESD1CAN
D4 = OLIMEX_DISCRET:SMBJ16A
HS-CAN MS-CAN SPEAKER WAKE-UP = SparkFun:JUMPER-2: Jumper Basic 0.1" spaced jumper. Use with breakaway headers.
IC1 IC2 = ADM3053:ADM3053: Signal and Power Isolated CAN Transceiver Analog Devices - Signal and Power Isolated CAN Transceiver with Integrated Isolated DC-to-DC Converter
IC4 = DS3231_industrialberry:DS3231
L1 L3-L6 = rcl:L-US: INDUCTOR, American symbol
L11 = OLIMEX_DISCRET:L
LED2 LED3 PWR_LED = DOUBLE-SIDE:LED
OOBD2-CONNECTOR = pinhead:PINHD-2X5: PIN HEADER
OOBDPICAN = jumper:JP3Q: JUMPER
R1-R5 R7 R19-R30 R40 R41 R47-R49 R54 R55 R69 R70 R84-R86 = rcl:R-EU_: RESISTOR, European symbol
R6 R10-R18 R31-R33 = resistor:R-EU_: RESISTOR, European symbol
R8 R9 = resistor:R-EU_: RESISTOR, European symbol; MANEX: 110-0002014
TLV320AIC3107 = TLV320AIC3107:TLV320AIC3107
U1 U3 = OLIMEX_IC:SY6280
U2 U6 = arm:MCP2551
U4 = SparkFun-PowerIC:V_REG_LDO: Voltage Regulator LDO Standard 150mA LDO voltage regulator in SOT-23 layout. Micrel part MIC5205. BP (by-pass) pin is used to lower output noise with 470pF cap.
U10 = OLIMEX_IC:MP1482
USB_HOST = OLIMEX_CONNECTORS:USB_SHIELD
USB_OTG = OLIMEX_CONNECTORS:MINI_USB9

## Net classes
2 lan_sh: clearance 0.762 mm